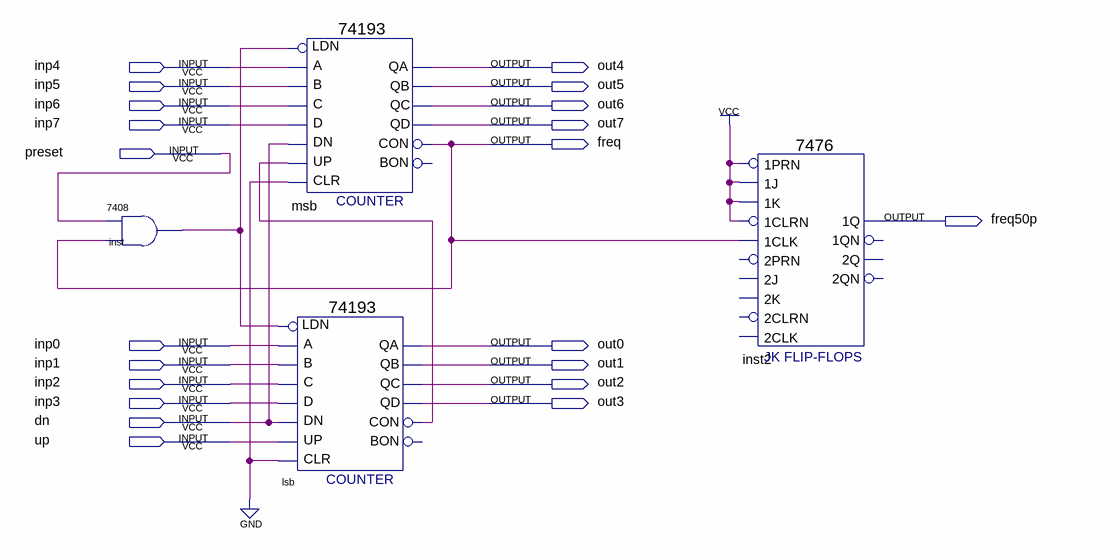
[diagram p0: schematic sheet]
// Quartus schematic freq_divider.bdf as structural Verilog: 4 symbols, 21 pins
module freq_divider (
  input  inp4,
  input  inp5,
  input  inp6,
  input  inp7,
  input  preset,
  input  inp0,
  input  inp1,
  input  inp2,
  input  inp3,
  input  dn,
  input  up,
  output out4,
  output out5,
  output out6,
  output out7,
  output freq,
  output freq50p,
  output out0,
  output out1,
  output out2,
  output out3
);

  wire inst_1, lsb_con;

  \7408  inst (.\3 (freq), .\2 (preset), .\1 (inst_1));
  \74193  msb (
    .D(inp7), .C(inp6), .B(inp5), .A(inp4), .CLR(1'b0), .UP(lsb_con), .DN(dn), .LDN(inst_1), .QB(out5),
    .QA(out4), .CON(freq), .QD(out7), .QC(out6));  // open: BON
  \74193  lsb (
    .D(inp3), .C(inp2), .B(inp1), .A(inp0), .CLR(1'b0), .UP(up), .DN(dn), .LDN(inst_1), .QB(out1), .QA(out0),
    .CON(lsb_con), .QD(out3), .QC(out2));  // open: BON
  \7476  inst2 (
    .\1J (1'b1), .\1K (1'b1), .\1PRN (1'b1), .\1CLK (freq), .\1CLRN (1'b1), .\1Q (freq50p));  // open: 2PRN, 2J, 2K, 2CLRN, 2CLK, 2QN, 2Q, 1QN
endmodule
